# EAGLE design processing (EAGLE 6.5.0)
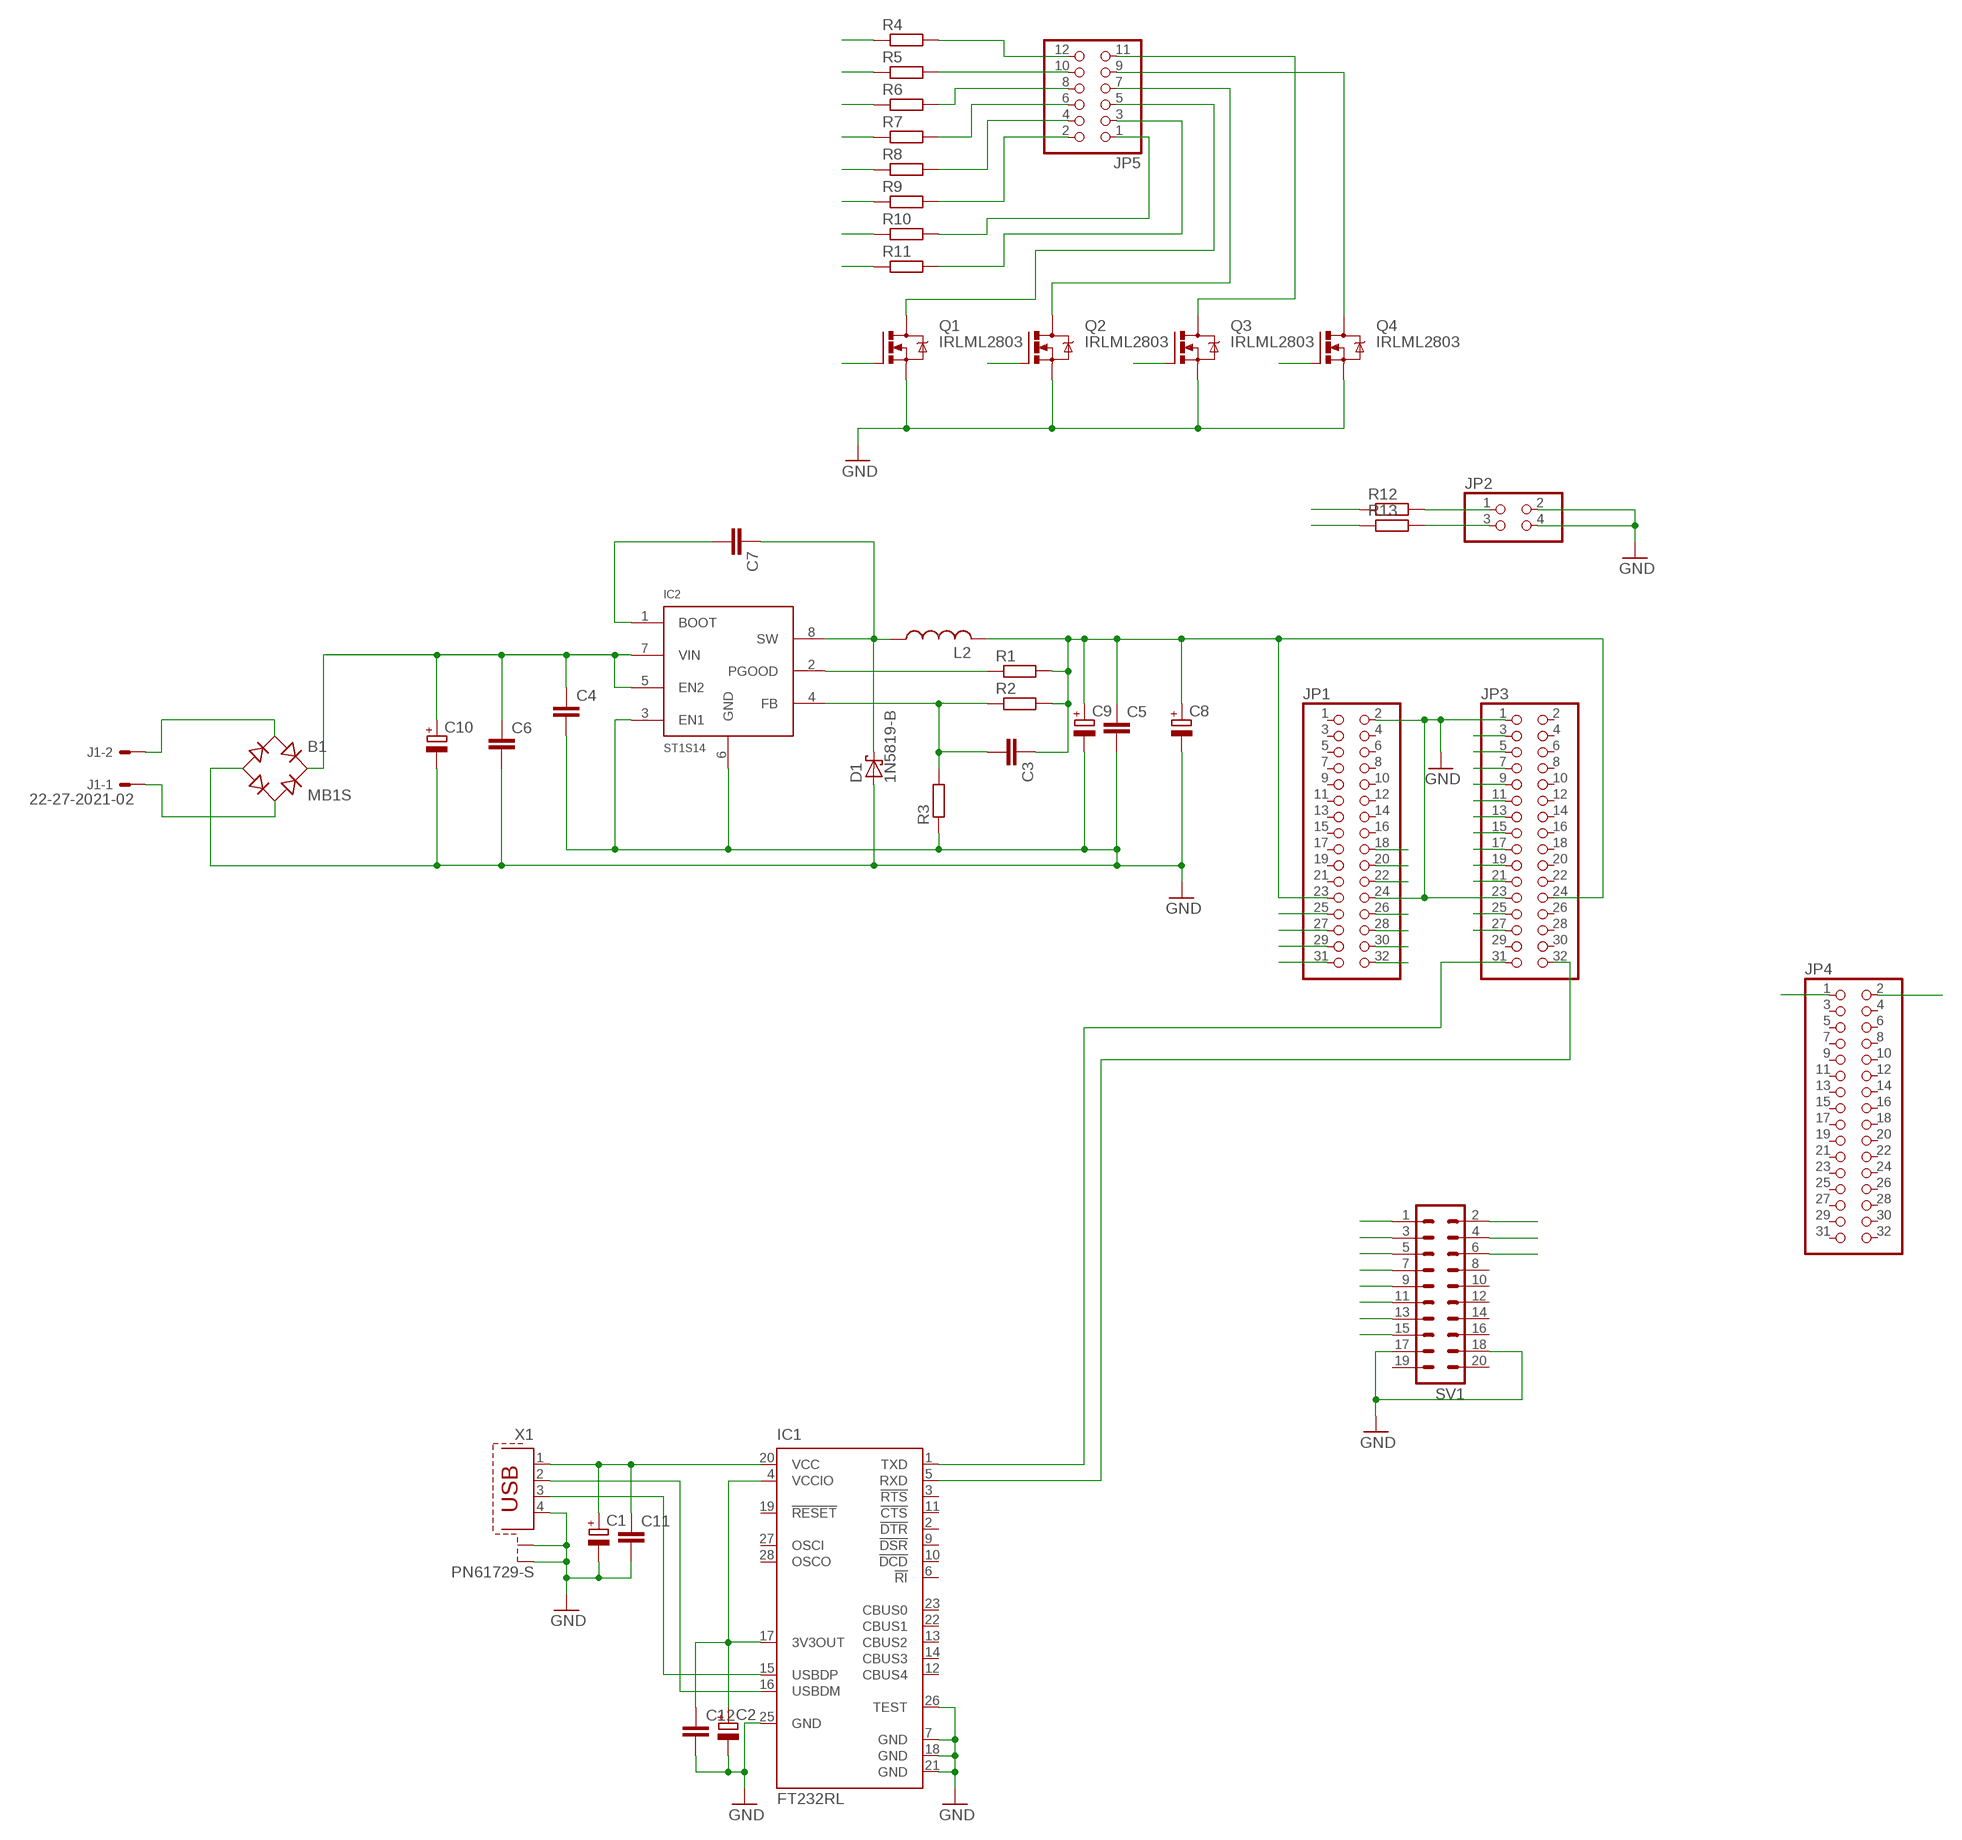
[diagram p0: schematic, sheet 1]

## Parts
B1  MB1S  [SOIC-4]
C1  CPOL-EUE2.5-5  [E2,5-5]
C2  CPOL-EUE2.5-5  [E2,5-5]
C3  C-EUC0805  [C0805]
C4  C-EUC0805  [C0805]
C5  C-EUC0805  [C0805]
C6  C-EUC0805  [C0805]
C7  C-EUC0805  [C0805]
C8  CPOL-EUE2.5-6  [E2,5-6]
C9  CPOL-EUSMCB  [SMC_B]
C10  CPOL-EUE2.5-7  [E2,5-7]
C11  C-EUC0603  [C0603]
C12  C-EUC0603  [C0603]
D1  1N5819-B  [DO41-7.6]
IC1  FT232RL  [SSOP28]
IC2  ST1S14  [SO8]
J1  22-27-2021-02  [6410-02]
JP1  PINHD-2X16M  [2X16M]
JP2  PINHD-2X2  [2X02]
JP3  PINHD-2X16M  [2X16M]
JP4  PINHD-2X16M  [2X16M]
JP5  PINHD-2X6  [2X06]
L2  L-USWE-TPC  [POWER-CHOKE_WE-TPC]
Q1  IRLML2803  [SOT23]
Q2  IRLML2803  [SOT23]
Q3  IRLML2803  [SOT23]
Q4  IRLML2803  [SOT23]
R1  R-EU_R0805  [R0805]
R2  R-EU_R0805  [R0805]
R3  R-EU_R0805  [R0805]
R4  R-EU_R0603  [R0603]
R5  R-EU_R0603  [R0603]
R6  R-EU_R0603  [R0603]
R7  R-EU_R0603  [R0603]
R8  R-EU_R0603  [R0603]
R9  R-EU_R0603  [R0603]
R10  R-EU_R0603  [R0603]
R11  R-EU_R0603  [R0603]
R12  R-EU_R0603  [R0603]
R13  R-EU_R0603  [R0603]
SV1  MA10-2W  [MA10-2W]
X1  PN61729-S  [PN61729-S]

## Nets
GND: B1.- C1.- C2.- C4.2 C5.2 C6.2 C8.- C9.- C10.- C11.2 C12.2 D1.A IC1.7(GND) IC1.18(GND) IC1.21(GND) IC1.25(GND) IC1.26(TEST) IC2.3(EN1) IC2.6(GND) JP1.2 JP1.24 JP2.2 JP2.4 JP3.1 JP3.23 Q1.2(S) Q2.2(S) Q3.2(S) Q4.2(S) R3.1 SV1.17 SV1.18 X1.4 X1.S1 X1.S2
L1: JP3.17 R4.1
L2: JP3.15 R5.1
L3: JP3.13 R6.1
L4: JP3.11 R7.1
L5: JP3.9 R8.1
L6: JP3.7 R9.1
L7: JP3.5 R10.1
L8: JP3.3 R11.1
LED1: JP4.1 R12.1
LED2: JP4.2 R13.1
N$1: IC1.16(USBDM) X1.2
N$2: IC1.15(USBDP) X1.3
N$3: C1.+ C11.1 IC1.20(VCC) X1.1
N$4: IC1.5(RXD) JP3.32
N$5: JP2.1 R12.2
N$6: B1.+ C4.1 C6.1 C10.+ IC2.5(EN2) IC2.7(VIN)
N$7: C7.2 IC2.1(BOOT)
N$8: C7.1 D1.C IC2.8(SW) L2.1
N$9: IC2.2(PGOOD) R1.1
N$10: C3.2 IC2.4(FB) R2.1 R3.2
N$11: C3.1 C5.1 C8.+ C9.+ JP1.23 JP3.24 L2.2 R1.2 R2.2
N$12: B1.~2(AC2) J1.1
N$13: C2.+ C12.1 IC1.4(VCCIO) IC1.17(3V3OUT)
N$14: JP5.12 R4.2
N$15: JP5.10 R5.2
N$16: JP5.8 R6.2
N$17: JP5.6 R7.2
N$18: JP5.4 R8.2
N$19: JP5.2 R9.2
N$20: JP5.9 Q4.3(D)
N$21: JP5.11 Q3.3(D)
N$22: JP5.7 Q2.3(D)
N$23: JP5.5 Q1.3(D)
N$24: JP5.3 R11.2
N$25: JP5.1 R10.2
N$26: B1.~1(AC1) J1.2
N$27: IC1.1(TXD) JP3.31
N$31: JP2.3 R13.2
Q1: JP3.27 Q1.1(G)
Q2: JP3.25 Q2.1(G)
Q3: JP3.19 Q3.1(G)
Q4: JP3.21 Q4.1(G)
R1: JP1.18 SV1.6
R2: JP1.20 SV1.4
R3: JP1.22 SV1.2
R4: JP1.26 SV1.1
R5: JP1.28 SV1.3
R6: JP1.30 SV1.5
R7: JP1.32 SV1.7
R8: JP1.31 SV1.9
R9: JP1.29 SV1.11
R10: JP1.27 SV1.13
R11: JP1.25 SV1.15
Unconnected: IC1.2(!DTR) IC1.3(!RTS) IC1.6(!RI) IC1.9(!DSR) IC1.10(!DCD) IC1.11(!CTS) IC1.12(CBUS4) IC1.13(CBUS2) IC1.14(CBUS3) IC1.19(!RESET) IC1.22(CBUS1) IC1.23(CBUS0) IC1.27(OSCI) IC1.28(OSCO) JP1.1 JP1.3 JP1.4 JP1.5 JP1.6 JP1.7 JP1.8 JP1.9 JP1.10 JP1.11 JP1.12 JP1.13 JP1.14 JP1.15 JP1.16 JP1.17 JP1.19 JP1.21 JP3.2 JP3.4 JP3.6 JP3.8 JP3.10 JP3.12 JP3.14 JP3.16 JP3.18 JP3.20 JP3.22 JP3.26 JP3.28 JP3.29 JP3.30 JP4.3 JP4.4 JP4.5 JP4.6 JP4.7 JP4.8 JP4.9 JP4.10 JP4.11 JP4.12 JP4.13 JP4.14 JP4.15 JP4.16 JP4.17 JP4.18 JP4.19 JP4.20 JP4.21 JP4.22 JP4.23 JP4.24 JP4.25 JP4.26 JP4.27 JP4.28 JP4.29 JP4.30 JP4.31 JP4.32 SV1.8 SV1.10 SV1.12 SV1.14 SV1.16 SV1.19 SV1.20

## Library data of the parts
B1 = rectifier:MB*S: Bridge Rectifier Source: http://www.fairchildsemi.com/ds/MB/MB6S.pdf
C1 C2 C8-C10 = rcl:CPOL-EU: POLARIZED CAPACITOR, European symbol
C3-C7 C11 C12 = rcl:C-EU: CAPACITOR, European symbol
D1 = diode:1N581*: 1.0A SCHOTTKY BARRIER RECTIFIER Source: http://www.diodes.com/datasheets/ds23001.pdf
IC1 = ftdichip:FT232R: Source: http://www.ftdichip.com/Documents/DataSheets/DS_FT232R_v104.pdf; MPN: FT232RL; OC_FARNELL: 1146032; OC_NEWARK: 91K9918
IC2 = afc-smm:ST1S14
J1 = con-molex:22-?-02: CONNECTOR wire to board 2.54 mm (.1 inch) pitch header; OC_FARNELL: unknown; OC_NEWARK: unknown
JP1 JP3 JP4 = pinhead_2mm:PINHD-2X16: PIN HEADER
JP2 = afc-smm:PINHD-2X2: PIN HEADER
JP5 = afc-smm:PINHD-2X6: PIN HEADER
L2 = rcl:L-US: INDUCTOR, American symbol
Q1-Q4 = afc-smm:IRLML2803
R1-R13 = rcl:R-EU_: RESISTOR, European symbol
SV1 = afc-smm:MA10-2W: PIN HEADER; OC_FARNELL: unknown; OC_NEWARK: unknown
X1 = con-berg:PN61729-S: BERG USB connector; OC_FARNELL: unknown; OC_NEWARK: unknown

## Board
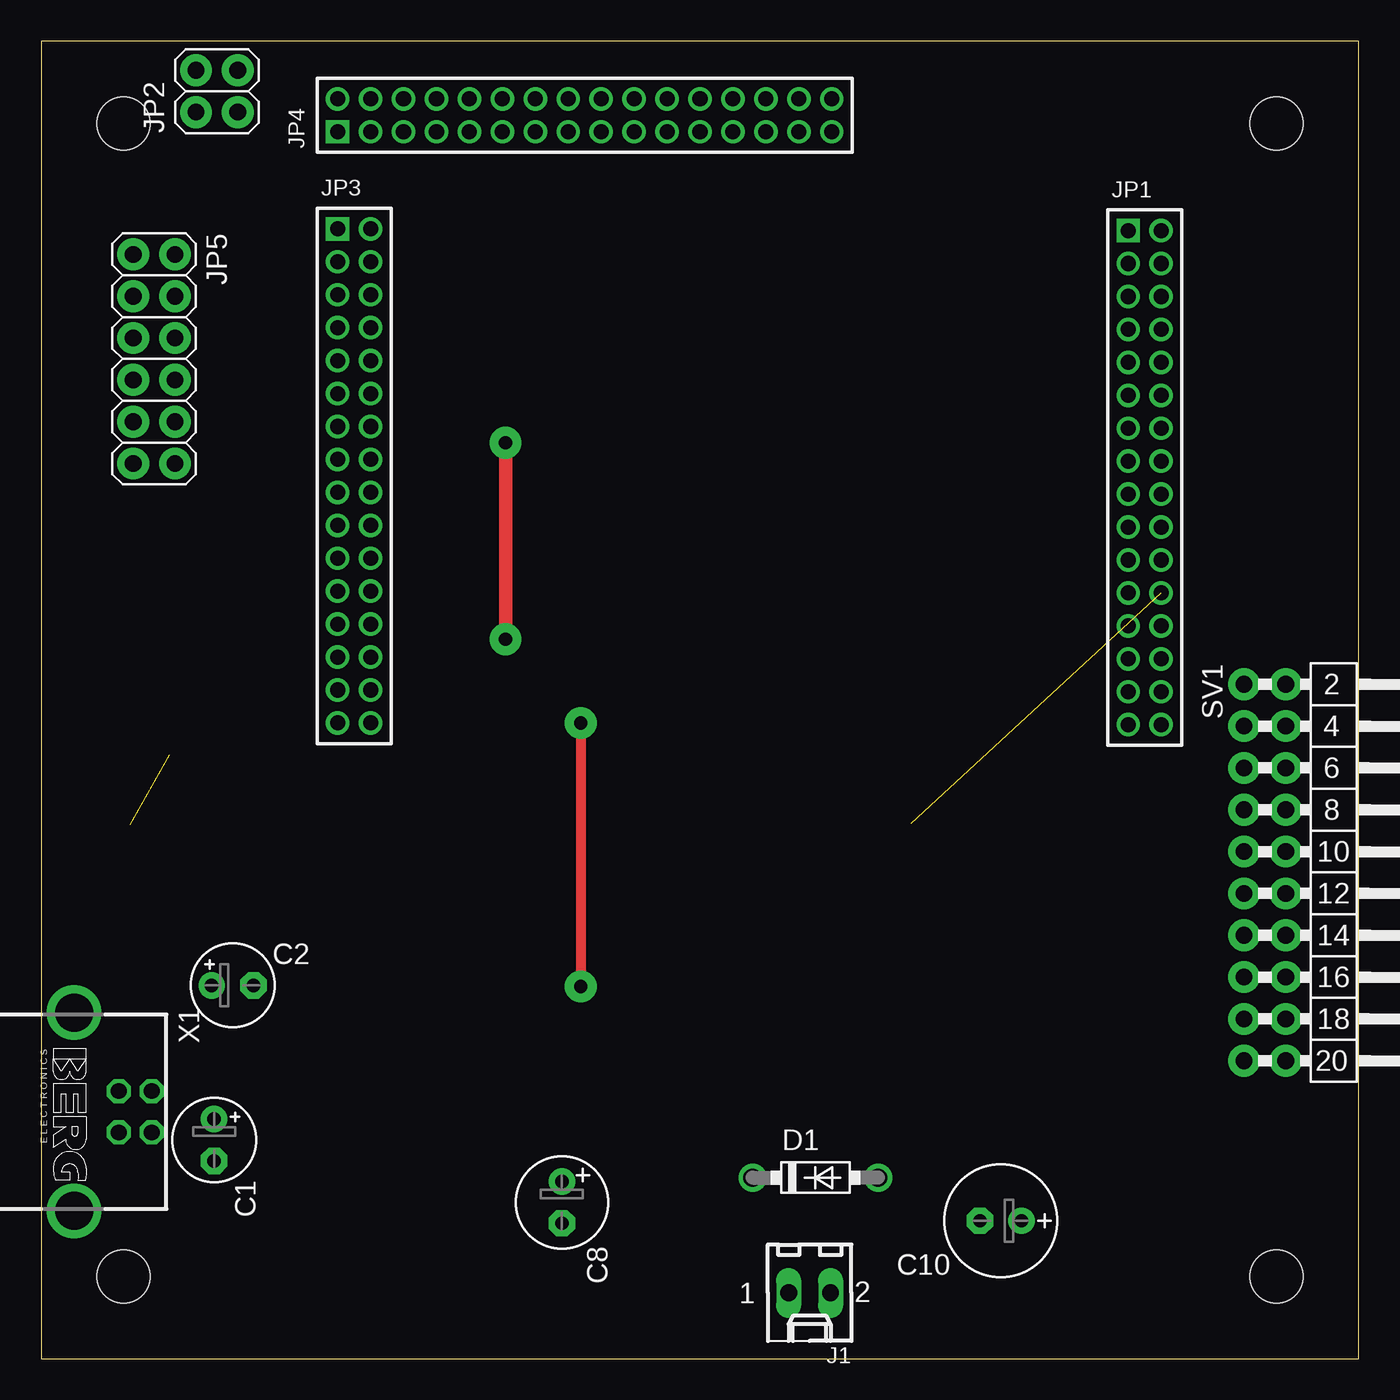
[diagram p1: board, top side]
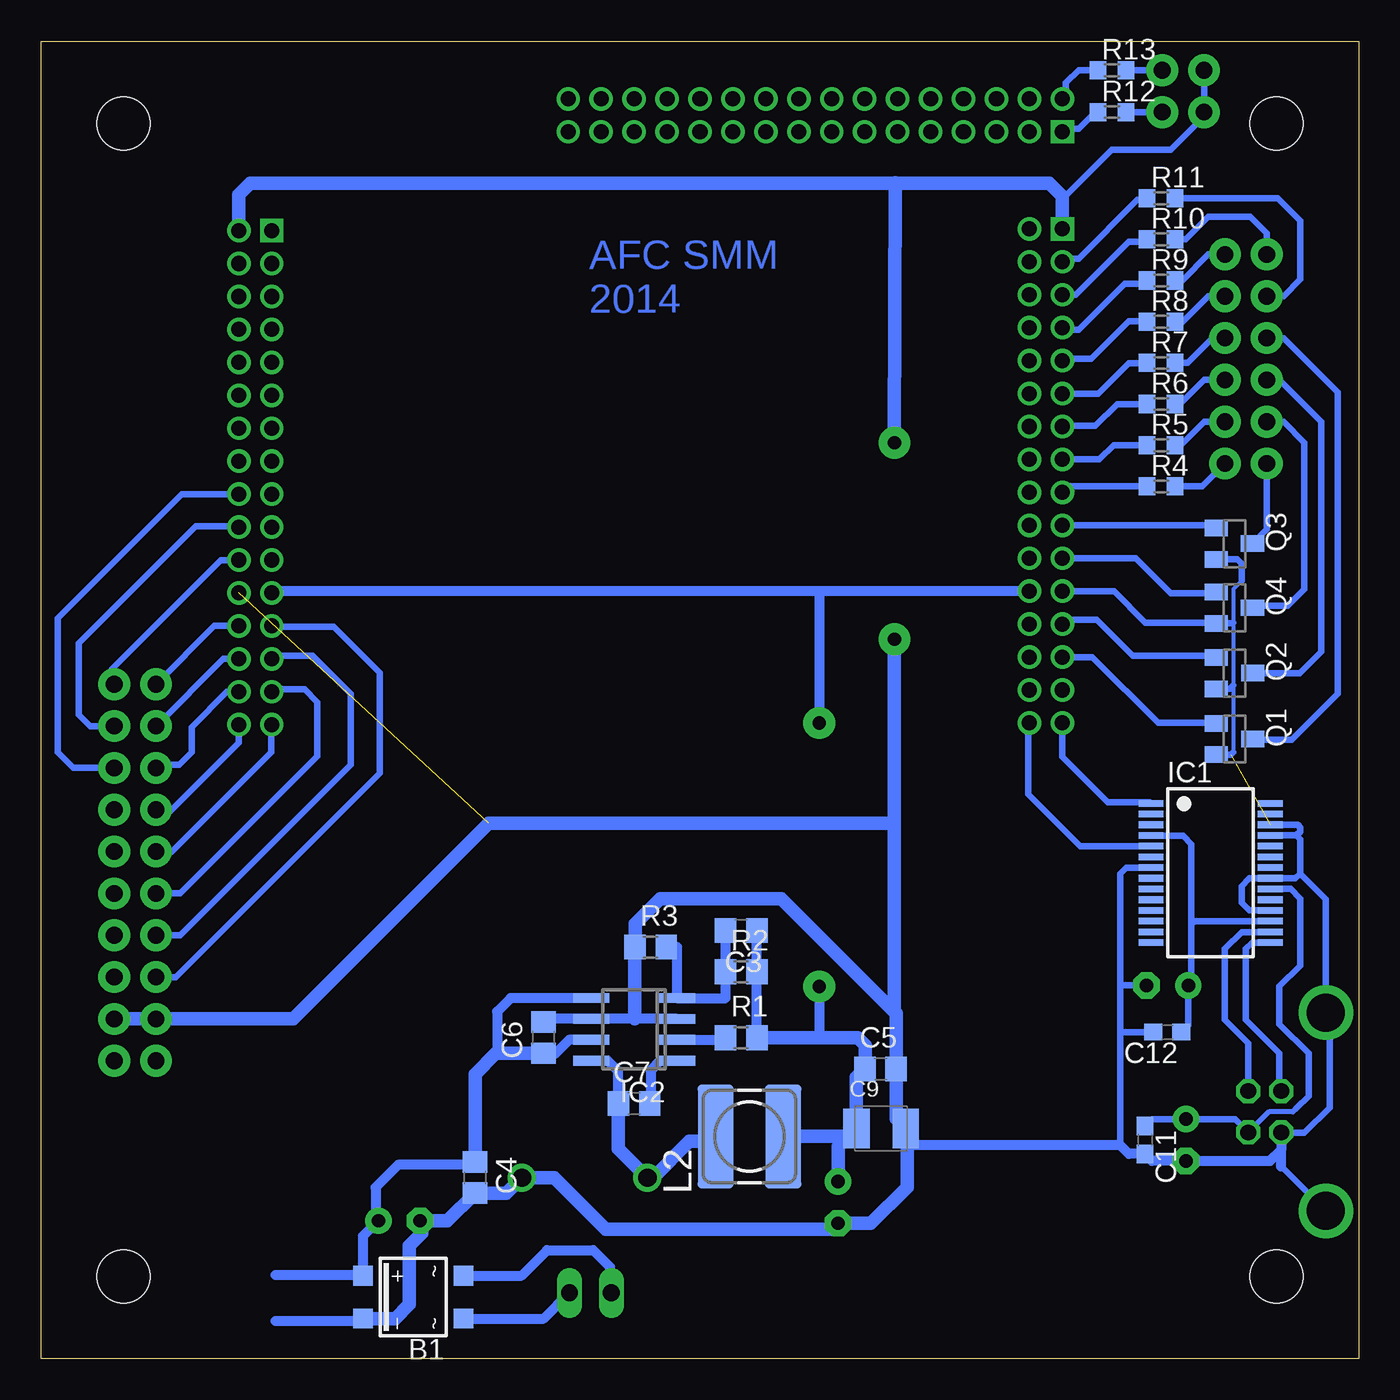
[diagram p2: board, bottom side, seen from below]

Size 80 x 80 mm. Coordinates in mm from the lower left corner, seen from the top.
Outline: 0,0 80,0 80,80 0,80 0,0
Copper layers (1*16): Top 0.035mm / dielectric 1.5mm / Bottom 0.035mm
Design rules "default": minimum track width 10mil, minimum drill 24mil, track to track 8mil, track to pad 8mil, pad to pad 8mil, via to via 8mil, smd to smd 8mil, copper to edge 40mil, drill to drill 8mil, minimum pad ring 10mil, minimum via ring 8mil, stop-mask expansion 4mil, vias tented up to drill 0mil, thermal gap 10mil
Holes 3.2 mm at 5,75 5,5 75,5 75,75

### Footprints (pad centres in the part's own frame; a part is rotated, then mirrored left to right if it is on the bottom)
SOIC-4 = smd 1.2 x 1.2: + 1.3,3.05; - -1.3,3.05; ~1 -1.3,-3.05; ~2 1.3,-3.05
E2,5-5 = drill 0.813 pad 1.6: + -1.27,0 | drill 0.813 pad 1.6 octagon: - 1.27,0
C0805 = smd 1.3 x 1.5: 1 -0.95,0; 2 0.95,0
E2,5-6 = drill 0.813 pad 1.6: + -1.27,0 | drill 0.813 pad 1.6 octagon: - 1.27,0
SMC_B = smd 1.6 x 2.4: + -1.5,0; - 1.5,0
E2,5-7 = drill 0.813 pad 1.6: + -1.27,0 | drill 0.813 pad 1.6 octagon: - 1.27,0
C0603 = smd 1.1 x 1: 1 -0.85,0; 2 0.85,0
DO41-7.6 = drill 1.1 pad 1.7: A 3.81,0; C -3.81,0
SSOP28 = smd 0.4 x 1.5: 1 -4.225,-3.625; 2 -3.575,-3.625; 3 -2.925,-3.625; 4 -2.275,-3.625; 5 -1.625,-3.625; 6 -0.975,-3.625; 7 -0.325,-3.625; 8 0.325,-3.625; 9 0.975,-3.625; 10 1.625,-3.625; 11 2.275,-3.625; 12 2.925,-3.625; 13 3.575,-3.625; 14 4.225,-3.625; 15 4.225,3.625; 16 3.575,3.625; 17 2.925,3.625; 18 2.275,3.625; 19 1.625,3.625; 20 0.975,3.625; 21 0.325,3.625; 22 -0.325,3.625; 23 -0.975,3.625; 24 -1.625,3.625; 25 -2.275,3.625; 26 -2.925,3.625; 27 -3.575,3.625; 28 -4.225,3.625
SO8 = smd 0.6 x 2.2: 1 -1.905,-2.6; 2 -0.635,-2.6; 3 0.635,-2.6; 4 1.905,-2.6; 5 1.905,2.6; 6 0.635,2.6; 7 -0.635,2.6; 8 -1.905,2.6
6410-02 = drill 1.016 long: 1 1.27,0; 2 -1.27,0
2X16M = drill 0.914 square: 1 -15,-1 | drill 0.914: 2 -15,1; 3 -13,-1; 4 -13,1; 5 -11,-1; 6 -11,1; 7 -9,-1; 8 -9,1; 9 -7,-1; 10 -7,1; 11 -5,-1; 12 -5,1; 13 -3,-1; 14 -3,1; 15 -1,-1; 16 -1,1; 17 1,-1; 18 1,1; 19 3,-1; 20 3,1; 21 5,-1; 22 5,1; 23 7,-1; 24 7,1; 25 9,-1; 26 9,1; 27 11,-1; 28 11,1; 29 13,-1; 30 13,1; 31 15,-1; 32 15,1
2X02 = drill 1.016 pad 1.93: 1 -1.27,-1.27; 2 -1.27,1.27; 3 1.27,-1.27; 4 1.27,1.27
2X06 = drill 1.016 pad 1.93: 1 -6.35,-1.27; 2 -6.35,1.27; 3 -3.81,-1.27; 4 -3.81,1.27; 5 -1.27,-1.27; 6 -1.27,1.27; 7 1.27,-1.27; 8 1.27,1.27; 9 3.81,-1.27; 10 3.81,1.27; 11 6.35,-1.27; 12 6.35,1.27
POWER-CHOKE_WE-TPC = smd 6.3 x 2.2: 1 0,2.05; 2 0,-2.05
SOT23 = smd 1 x 1.4: 1 -0.95,-1.1; 2 0.95,-1.1; 3 0,1.1
R0805 = smd 1.3 x 1.5: 1 -0.95,0; 2 0.95,0
R0603 = smd 1 x 1.1: 1 -0.85,0; 2 0.85,0
MA10-2W = drill 1.016 pad 1.93: 1 -11.43,-1.27; 2 -11.43,1.27; 3 -8.89,-1.27; 4 -8.89,1.27; 5 -6.35,-1.27; 6 -6.35,1.27; 7 -3.81,-1.27; 8 -3.81,1.27; 9 -1.27,-1.27; 10 -1.27,1.27; 11 1.27,-1.27; 12 1.27,1.27; 13 3.81,-1.27; 14 3.81,1.27; 15 6.35,-1.27; 16 6.35,1.27; 17 8.89,-1.27; 18 8.89,1.27; 19 11.43,-1.27; 20 11.43,1.27
PN61729-S = drill 0.95 octagon: 1 1.25,4.71; 2 -1.25,4.71; 3 -1.25,2.71; 4 1.25,2.71 | drill 2.3 pad 2.9: S1 -6.02,0; S2 6.02,0

### Placement (x,y rotation side)
B1  57.4,3.75 90 bottom
C1  10.5,13.29 270 top
C2  11.62,22.67 0 top
C3  37.5,26 180 bottom
C4  53.66,11.01 270 bottom
C5  29.04,17.6 0 bottom
C6  49.5,19.5 90 bottom
C7  44,15.5 0 bottom
C8  31.62,9.5 270 top
C9  29.01,13.99 0 bottom
C10  58.26,8.38 180 top
C11  12.98,13.29 270 bottom
C12  11.62,19.84 180 bottom
D1  47,11 0 top
IC1  9,29.5 270 bottom
IC2  44,20 90 bottom
J1  46.66,4.01 180 top
JP1  67,53.5 270 top
JP2  10.67,76.96 90 top
JP3  19,53.61 270 top
JP4  33,75.5 0 top
JP5  6.86,60.71 270 top
L2  37,13.5 90 bottom
Q1  7.54,37.63 270 bottom
Q2  7.54,41.63 270 bottom
Q3  7.55,49.49 270 bottom
Q4  7.55,45.6 270 bottom
R1  37.5,19.5 0 bottom
R2  37.5,23.5 0 bottom
R3  43,25 0 bottom
R4  12,52.97 0 bottom
R5  12,55.47 0 bottom
R6  12,57.97 0 bottom
R7  12,60.47 0 bottom
R8  12,62.97 0 bottom
R9  12,65.47 0 bottom
R10  12,67.97 0 bottom
R11  12,70.47 0 bottom
R12  14.99,75.69 0 bottom
R13  14.99,78.23 0 bottom
SV1  74.3,29.53 270 top
X1  2,15 270 top

### Tracks (layer width: path | path; a pad name or v marks a point on that pad's centre or on a via)
GND  (via drill 0.8 pad 1.93)  (2 unrouted)
  Top 0.813: v28.19,55.63 v28.19,43.69
  Bottom 0.254: 7.11,47.24 7.62,46.74 7.62,44.7 7.62,40.89 7.62,36.83
  Bottom 0.305: 44,25.05 R3.1 | D1.A 50.81,10.81
  Bottom 0.406: IC1.18 6.65,27.23 7.11,27.69 7.11,28.7 6.64,29.18 IC1.21 3.85,29.18 3.56,29.46 | IC1.26 3.72,32.42 3.56,32.26 3.56,32 3.79,31.77 | 3.79,31.77 IC1.25 | 3.56,29.46 3.56,31.55 3.79,31.77 | 12.56,12.02 C11.2 | 4.71,11.69 X1.S2 | IC1.7 14.12,29.82 14.48,29.46 14.48,22.61 | 14.48,22.61 14.48,19.81 | 14.48,19.81 14.48,12.95 | 2,21.05 1.78,20.83 1.78,15.24 3.3,13.72 4.68,13.72 X1.4 | 4.71,12.7 4.77,12.64 4.71,12.58 | Q3.2 7.39,48.54 7.11,48.26 7.11,47.24 | Q1.2 7.77,36.68 7.62,36.83 | Q2.2 7.84,40.68 7.62,40.89 | Q4.2 7.67,44.65 7.62,44.7 | 8.98,44.32 Q4.2 | 18.03,70.36 14.99,73.41 11.43,73.41 9.4,75.44 JP2.2 JP2.4 | 18.03,70.61 18.03,70.36 | 18.03,70.36 18.03,68.64 JP3.1 | 3.56,29.46 2,27.91 X1.S1 2,21.05 | 28.19,20.32 28.19,21.08 | JP3.23 14.86,46.61 12.95,44.7 8.71,44.7 Q4.2 | 2,21.05 2.03,21.08 | C12.2 14.45,19.84 14.48,19.81 | C2.- 14.41,22.67 14.48,22.61
  Bottom 0.61: 12.56,12.02 C1.- 5.39,12.02 4.77,12.64 | C11.2 13.96,12.44 14.48,12.95 27.43,12.95 27.43,12.45 | X1.4 4.71,12.7 | 4.71,11.69 4.71,12.58 | 43.95,20.64 IC2.3 IC2.6 49.31,20.64 C6.2 | 31.59,8.2 C8.- | 27.43,14.22 27.18,14.48 27.18,14.32 C9.- | R3.1 | 56.9,8.29 C10.-
  Bottom 0.813: 43.95,20.64 R3.1 | 27.43,14.22 27.43,12.45 27.43,10.41 29.62,8.23 C8.- 31.97,7.87 45.72,7.87 48.85,11 D1.A 51.75,10.06 C4.2 55.33,8.38 C10.- | C9.- 28.09,14.57 C5.2 28.09,20.98 28.19,21.08 | 28.19,21.08 35.05,27.94 42.42,27.94 43.94,26.42 R3.1 | B1.- 58.51,2.45 57.66,3.3 57.66,6.86 56.9,7.62 56.9,8.29 | JP1.2 68,70.68 67.31,71.37 28.13,71.37 | JP3.1 18,70.58 18.03,70.61 18.8,71.37 28.13,71.37 | SV1.18 SV1.17 64.71,20.64 52.83,32.51 28.19,32.51 | 28.19,21.08 28.19,32.51 | 28.19,32.51 v28.19,43.69 | v28.19,55.63 28.16,71.41 28.13,71.37
L1
  Bottom 0.406: R4.1 17.64,52.97 JP3.17
L2
  Bottom 0.406: R5.1 14.89,55.47 15.75,54.61 JP3.15
L3
  Bottom 0.406: R6.1 14.68,57.97 16,56.64 17.96,56.64 JP3.13
L4
  Bottom 0.406: JP3.11 15.82,58.61 13.97,60.45 12.87,60.45 R7.1
L5
  Bottom 0.406: R8.1 12.87,62.99 13.97,62.99 16.26,60.71 17.9,60.71 JP3.9
L6
  Bottom 0.406: R9.1 13.04,65.28 14.22,65.28 17.02,62.48 17.88,62.48 JP3.7
L7
  Bottom 0.406: JP3.5 17.18,64.61 13.97,67.82 13,67.82 R10.1
L8
  Bottom 0.406: R11.1 12.96,70.36 13.46,70.36 17.02,66.8 17.8,66.8 JP3.3
LED1
  Bottom 0.406: R12.1 16,75.69 17.02,74.68 17.82,74.68 JP4.1
LED2
  Bottom 0.406: R13.1 17.02,78.23 17.78,77.47 17.78,76.72 JP4.2
N$1
  Bottom 0.406: X1.2 6.71,19.16 8.13,20.57 8.13,24.89 7.11,25.91 5.39,25.91 IC1.16
N$2
  Bottom 0.406: IC1.15 6.47,25.27 6.86,24.89 6.86,20.57 4.83,18.54 4.83,16.37 X1.3
N$3
  Bottom 0.305: 3.5,15.5 3.79,15.21 4,15 5.46,15 X1.1
  Bottom 0.406: C11.1 12.56,14.56 C1.+ 7.52,14.56 X1.1 | IC1.20 4.14,28.52 3.56,27.94 3.56,23.88 4.83,22.61 4.83,20.32 3.05,18.54 3.05,15.95 3.79,15.21
N$4
  Bottom 0.406: IC1.5 16.9,31.12 20.07,34.29 20.07,38.54 JP3.32
N$5
  Bottom 0.406: R12.2 JP2.1
N$6
  Bottom 0.61: IC2.7 47.95,19.36 48.77,18.54 C6.1 | IC2.5 51.5,21.91 52.32,21.08 52.32,18.63 52.4,18.55 | C4.1 53.84,11.78 58.33,11.78 59.69,10.41 59.69,8.54 C10.+ 60.45,7.46 B1.+
  Bottom 0.813: C6.1 52.4,18.55 53.66,17.29 C4.1
N$7
  Bottom 0.61: IC2.1 42.41,18.09 43,17.5 43,15.55 C7.2
N$8
  Bottom 0.61: 45,15.95 C7.1 45,15.55 45,17.5 45.59,18.09 IC2.8 | 39.34,13.21 L2.1
  Bottom 0.813: C7.1 44.95,12.76 D1.C 42.85,11 40.64,13.21 39.34,13.21
N$9
  Bottom 0.61: IC2.2 38.45,19.36 R1.1
N$10
  Bottom 0.61: C3.2 R2.1 38.45,21.91 IC2.4 41.4,25 R3.2
N$11  (via drill 0.8 pad 1.93)
  Top 0.61: v32.77,38.61 v32.77,22.61
  Bottom 0.61: R1.2 R2.2 C3.1 | L2.2 34.35,13.5 | 29.97,17.62 C5.1 | 32.77,46.61 65.89,46.61 JP1.23 | JP3.24 32.77,46.61 | 32.77,46.61 v32.77,38.61 | v32.77,22.61 32.77,19.5
  Bottom 0.813: 31.14,13.36 31.62,12.88 C8.+ | 31.14,13.36 C9.+ 30.51,17.08 C5.1 | R1.2 32.77,19.5 30.42,19.5 29.97,19.05 29.97,17.62 | 34.35,13.5 31.28,13.5 31.14,13.36
N$12
  Bottom 0.61: J1.1 45.47,4.09 45.47,5.59 46.48,6.6 49.28,6.6 50.83,5.05 B1.~2
N$13
  Bottom 0.406: 10.16,26.42 10.16,31.24 10.67,31.75 12.6,31.75 IC1.4 | IC1.17 10,26.57 10.16,26.42 | 10.16,26.42 10.16,22.86 C2.+ 10.35,20.26 C12.1
N$14
  Bottom 0.406: R4.2 9.52,52.97 JP5.12
N$15
  Bottom 0.406: R5.2 10.83,55.47 9.4,56.9 JP5.10
N$16
  Bottom 0.406: R6.2 10.87,57.97 9.4,59.44 JP5.8
N$17
  Bottom 0.406: R7.2 10.4,60.47 8.89,61.98 JP5.6
N$18
  Bottom 0.406: R8.2 10.69,62.97 9.14,64.52 JP5.4
N$19
  Bottom 0.406: R9.2 10.73,65.47 9.14,67.06 JP5.2
N$20
  Bottom 0.406: Q4.3 6.33,45.72 4.32,45.72 3.3,46.74 3.3,55.63 4.57,56.9 JP5.9
N$21
  Bottom 0.406: JP5.11 5.59,50.36 Q3.3
N$22
  Bottom 0.406: Q2.3 3.59,41.63 2.29,42.93 2.29,56.9 4.83,59.44 JP5.7
N$23
  Bottom 0.406: Q1.3 6.4,37.59 4.06,37.59 1.27,40.39 1.27,58.67 4.57,61.98 JP5.5
N$24
  Bottom 0.406: R11.2 4.94,70.47 3.56,69.09 3.56,65.53 4.57,64.52 JP5.3
N$25
  Bottom 0.406: R10.2 10.52,67.97 9.14,69.34 6.6,69.34 5.59,68.33 JP5.1
N$26
  Bottom 0.61: J1.2 49.49,2.45 B1.~1
N$27
  Bottom 0.406: JP3.31 18,36.54 15.24,33.78 12.68,33.78 IC1.1
N$28
  Bottom 0.61: 60.45,5.08 65.79,5.08
N$30
  Bottom 0.61: 60.45,2.29 65.79,2.29
N$31
  Bottom 0.406: R13.2 JP2.3
Q1
  Bottom 0.406: JP3.27 16.19,42.61 12.19,38.61 8.67,38.61 Q1.1
Q2
  Bottom 0.406: JP3.25 17.74,44.86 15.91,44.86 13.72,42.67 8.74,42.67 Q2.1
Q3
  Bottom 0.406: JP3.19 8.82,50.61 Q3.1
Q4
  Bottom 0.406: 8.88,46.32 Q4.1 8.72,46.48 11.43,46.48 13.55,48.61 JP3.21
R1
  Bottom 0.406: SV1.6 78.04,35.88 78.99,36.83 78.99,44.96 71.45,52.5 JP1.18
R2
  Bottom 0.406: SV1.4 77.03,38.42 77.72,39.12 77.72,43.43 70.61,50.55 68.05,50.55 JP1.20
R3
  Bottom 0.406: JP1.22 69.1,48.5 75.69,41.91 75.69,41.08 SV1.2
R4
  Bottom 0.406: JP1.26 69.48,44.5 SV1.1
R5
  Bottom 0.406: JP1.28 68.94,42.5 SV1.3
R6
  Bottom 0.406: JP1.30 68.72,40.5 70.87,38.35 70.87,36.83 71.63,36.07 72.83,36.07 SV1.5
R7
  Bottom 0.406: JP1.32 68,37.41 72.14,33.27 72.96,33.27 SV1.7
R8
  Bottom 0.406: SV1.9 72.07,30.8 66.04,36.83 66.04,38.46 JP1.31
R9
  Bottom 0.406: SV1.11 71.56,28.26 63.25,36.58 63.25,39.88 64.01,40.64 65.86,40.64 JP1.29
R10
  Bottom 0.406: SV1.13 71.56,25.72 61.21,36.07 61.21,40.39 63.5,42.67 65.83,42.67 JP1.27
R11
  Bottom 0.406: JP1.25 65.95,44.45 62.23,44.45 59.44,41.66 59.44,35.56 71.82,23.18 SV1.15

### Text on the board
Bottom: AFC SMM / 2014